# EAGLE design pcb-main (EAGLE 7.4.0)
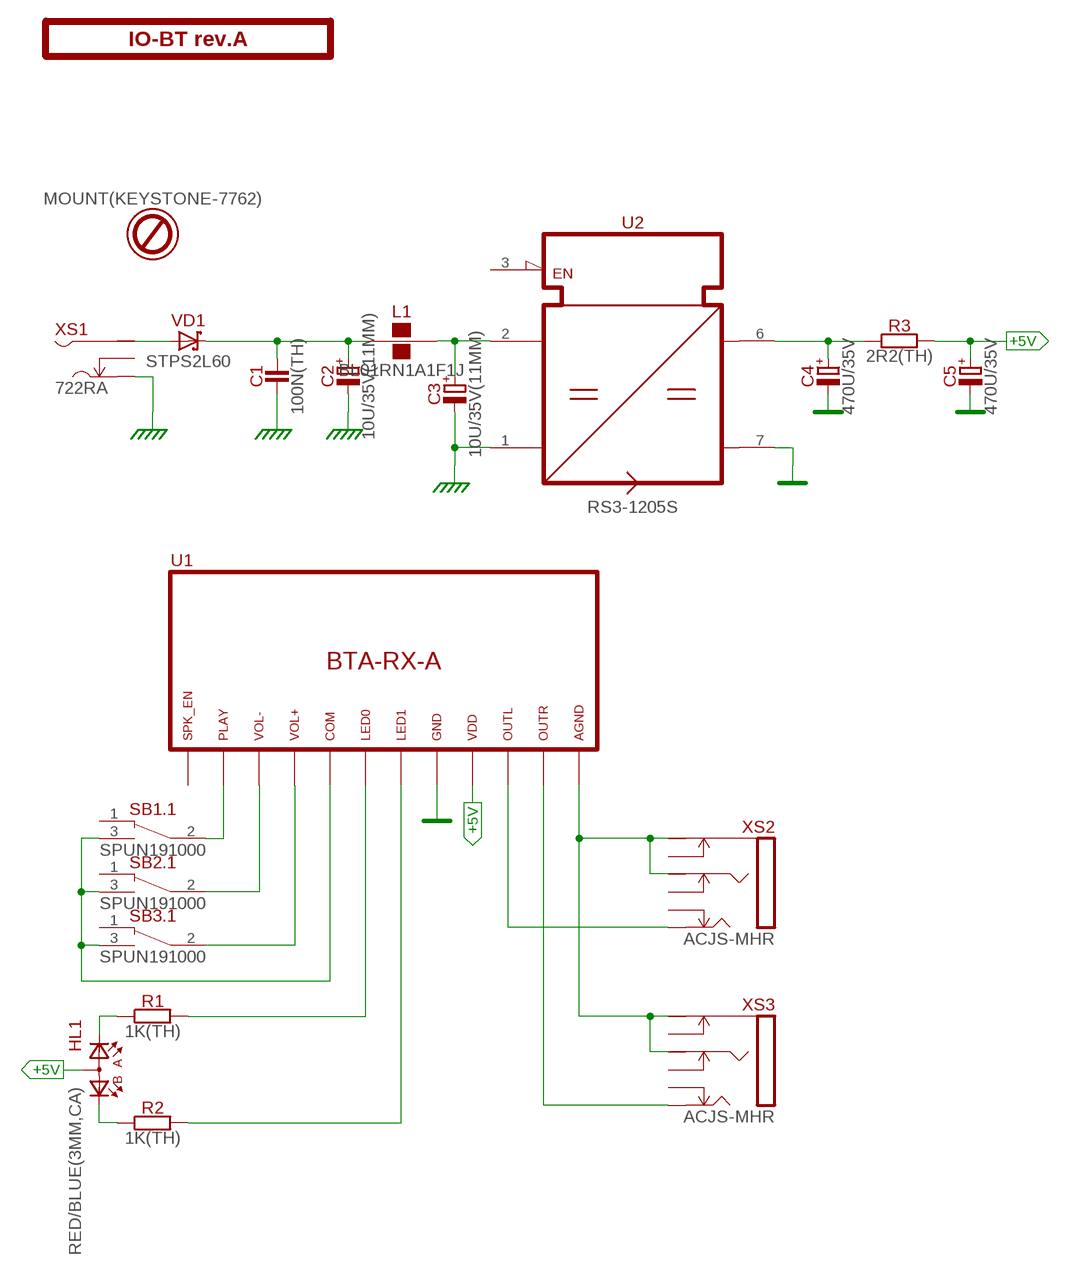
[diagram p0: schematic, sheet 1]

## Parts
C1  100N(TH)  [C050-024X044]
C2  10U/35V(11MM)  [E2-5]
C3  10U/35V(11MM)  [E2-5]
C4  470U/35V  [E5-10,5]
C5  470U/35V  [E5-10,5]
HL1  RED/BLUE(3MM,CA)  [DUOLED3MM-H]
L1  BL01RN1A1F1J  [BL01RN1A]
O1  MOUNT(KEYSTONE-7762)  [KEYSTONE-7762]
PCB1  IO-BT rev.A  GENERIC-LOGO  [F-LOGO]
R1  1K(TH)  [R-0207/10]
R2  1K(TH)  [R-0207/10]
R3  2R2(TH)  [R-0207/10]
SB1  SPUN191000  [SPUN-DPDT]
SB2  SPUN191000  [SPUN-DPDT]
SB3  SPUN191000  [SPUN-DPDT]
U1  BTA-RX-A  [BTA-RX]
U2  RS3-1205S  [SIP8]
VD1  STPS2L60  [DO41-10]
XS1  722RA  [SWITCHCRAFT-L712RA]
XS2  ACJS-MHR  [NMJ6HC-S]
XS3  ACJS-MHR  [NMJ6HC-S]

## Nets
+5V: C5.+ HL1.K(A) R3.2 U1.9
CHASSIS: C1.1 C2.- C3.- U2.1(IN-) XS1.S
GND: C4.- C5.- U1.8 U2.7(V-)
N$35: U1.12 XS2.R XS2.S XS3.R XS3.S
N$36: U1.10 XS2.T
N$37: U1.11 XS3.T
N$38: SB1.2(.1:CM) U1.2
N$39: SB2.2(.1:CM) U1.3
N$40: SB3.2(.1:CM) U1.4
N$41: SB1.3(.1:NO) SB2.3(.1:NO) SB3.3(.1:NO) U1.5
N$42: HL1.A1(K1) R1.1
N$43: HL1.A2(K2) R2.1
N$44: R1.2 U1.6
N$45: R2.2 U1.7
N$46: VD1.A XS1.P
N$47: C3.+ L1.2 U2.2(IN+)
N$48: C1.2 C2.+ L1.1 VD1.C
N$49: C4.+ R3.1 U2.6(V+)
Unconnected: O1.P$1 O1.P$2 O1.P$3 O1.P$4 SB1.1(.1:NC) SB1.4(.2:NC) SB1.5(.2:CM) SB1.6(.2:NO) SB2.1(.1:NC) SB2.4(.2:NC) SB2.5(.2:CM) SB2.6(.2:NO) SB3.1(.1:NC) SB3.4(.2:NC) SB3.5(.2:CM) SB3.6(.2:NO) U1.1 U2.3(EN) XS1.SS XS2.RN XS2.SN XS2.TN XS3.RN XS3.SN XS3.TN

## Library data of the parts
C1 = capacitors:?; MOUSER: 81-RCER71H104K0A2H3B
C2 C3 = capacitors-electrolytic:?; MOUSER: 75-515D106M035JA6AE3
C4 C5 = capacitors-electrolytic:?
HL1 = optoelectronics:?(3MM,CA)
L1 = inductors:BL01RN1A?; MOUSER: 81-BL01RN1A1F1J
O1 = hardware:MOUNT(?)
PCB1 = module-footprints:GENERIC
R1 R2 = resistors:?; MOUSER: 71-RN55D-F-1.0K
R3 = resistors:?
SB1-SB3 = switches:SPUN191000
U1 = module-wireless:BTA-RX-
U2 = regulators-switch-mode:RS3-1205S
VD1 = diodes-schottky:?; MOUSER: 511-STPS2L60RL
XS1 = connectors:722RA; MOUSER: 502-722RA
XS2 XS3 = connectors:ACJS-MHR; MOUSER: 523-ACJS-MHR

## Board
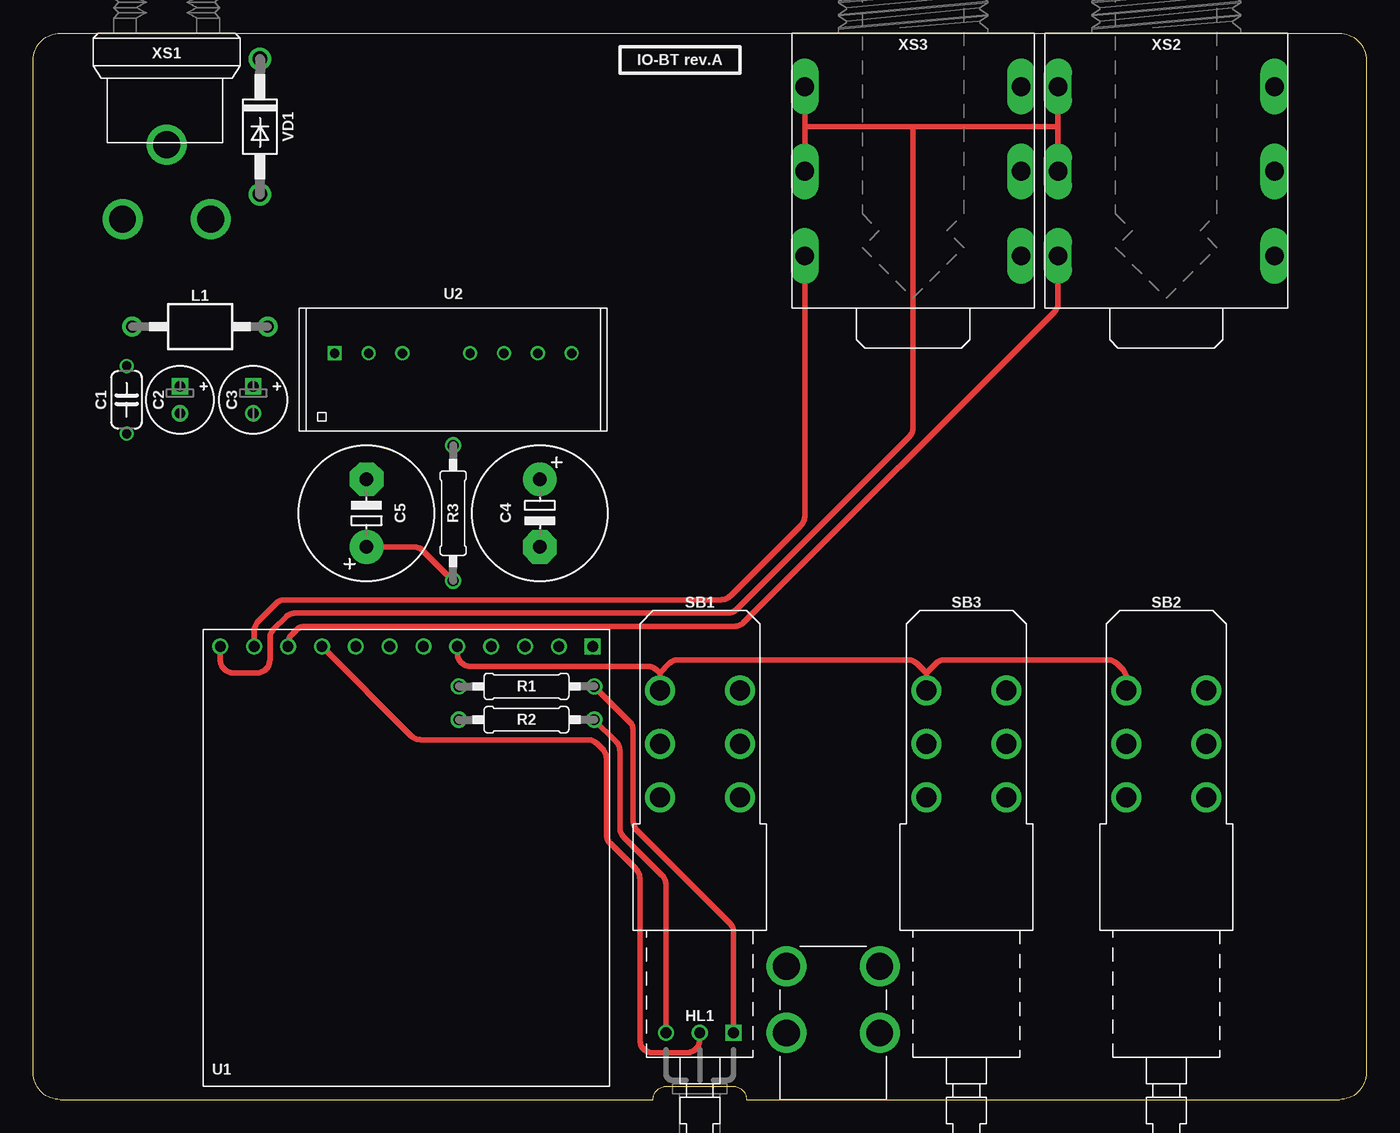
[diagram p1: board, top side]
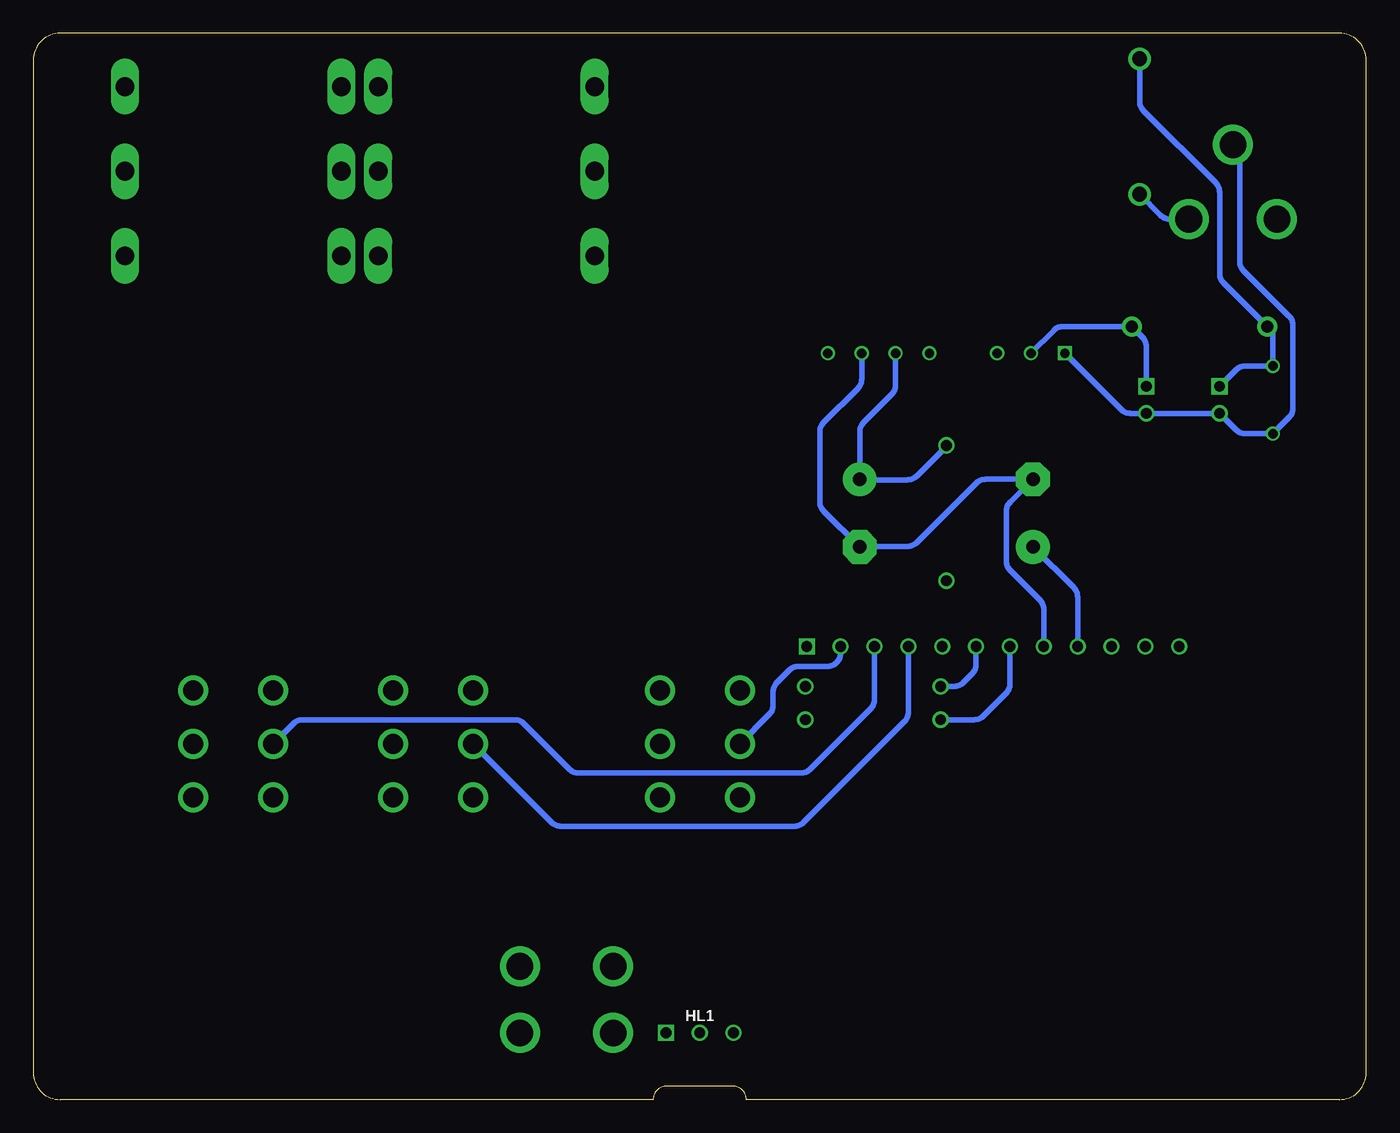
[diagram p2: board, bottom side, seen from below]

Size 100 x 80 mm. Coordinates in mm from the lower left corner, seen from the top.
Outline: 2,0 arc-90 0,2 0,78 arc-90 2,80 98,80 arc-90 100,78 100,2 arc-90 98,0 53.5,0 arc90 52.5,1 47.5,1 arc90 46.5,0 2,0
Copper layers (1*16): Top 0.0356mm / dielectric 1.5011mm / Bottom 0.0356mm
Design rules "fluorumlabs": minimum track width 6mil, minimum drill 13mil, track to track 8mil, track to pad 8mil, pad to pad 6mil, via to via 6mil, smd to smd 6mil, copper to edge 15mil, drill to drill 6mil, minimum pad ring 7mil, minimum via ring 7mil, stop-mask expansion 3mil, vias tented up to drill 25mil, thermal gap 10mil

### Footprints (pad centres in the part's own frame; a part is rotated, then mirrored left to right if it is on the bottom)
C050-024X044 = drill 0.7: 1 -2.54,0; 2 2.54,0
E2-5 = drill 0.813 square: + -1.016,0 | drill 0.813: - 1.016,0
E5-10,5 = drill 1.016 pad 2.54: + -2.54,0 | drill 1.016 pad 2.54 octagon: - 2.54,0
DUOLED3MM-H = drill 0.813 square: A1 -2.54,0 | drill 0.813: A2 2.54,0; K 0,0
BL01RN1A = drill 0.9 pad 1.5: 1 -5.08,0; 2 5.08,0
KEYSTONE-7762 = drill 2: P$1 -3.5,5; P$2 3.5,5; P$3 -3.5,10; P$4 3.5,10
R-0207/10 = drill 0.813: 1 -5.08,0; 2 5.08,0
SPUN-DPDT = drill 1.5: 1 3,-19.685; 2 3,-23.685; 3 3,-27.685; 4 -3,-19.685; 5 -3,-23.685; 6 -3,-27.685
BTA-RX = drill 0.8 square: 1 -13.97,0 | drill 0.8: 2 -11.43,0; 3 -8.89,0; 4 -6.35,0; 5 -3.81,0; 6 -1.27,0; 7 1.27,0; 8 3.81,0; 9 6.35,0; 10 8.89,0; 11 11.43,0; 12 13.97,0
SIP8 = drill 0.7 square: 1 -8.89,0 | drill 0.7: 2 -6.35,0; 3 -3.81,0; 5 1.27,0; 6 3.81,0; 7 6.35,0; 8 8.89,0
DO41-10 = drill 1.118: A 5.08,0; C -5.08,0
SWITCHCRAFT-L712RA = drill 2: P 13.945,3.302; S 8.357,0; SS 13.945,-3.302
NMJ6HC-S = drill 1.4 long: R -10.35,8.115; RN -10.35,-8.115; S -4,8.115; SN -4,-8.115; T -16.7,8.115; TN -16.7,-8.115

### Placement (x,y rotation side)
C1  7,52.5 90 top
C2  11,52.5 270 top
C3  16.5,52.5 270 top
C4  38,44 270 top
C5  25,44 90 top
E$1  [B*-080]  0,0 0 top
HL1  50,5 180 top
L1  12.5,58 0 top
O1  60,0 0 top
PCB1  48.5,78 0 top
R1  37,31 180 top
R2  37,28.5 180 top
R3  31.5,44 270 top
SB1  50,3 180 top
SB2  85,3 180 top
SB3  70,3 180 top
U1  28,34 180 top
U2  31.5,56 0 top
VD1  17,73 270 top
XS1  10,80 270 top
XS2  85,80 90 top
XS3  66,80 90 top

### Tracks (layer width: path | path; a pad name or v marks a point on that pad's centre or on a via)
+5V
  Top 0.406: C5.+ 28.55,41.46 arc-45 29.25,41.17 R3.2 | HL1.K 50,4.5 arc-90 49,3.5 46.5,3.5 arc-90 45.5,4.5 45.5,16.59 arc45 45.21,17.29 43.29,19.21 arc-45 43,19.91 43,25.59 arc45 42.71,26.29 42.29,26.71 arc45 41.59,27 29.06,27 arc-45 28.36,27.29 U1.9
  Bottom 0.406: U1.9 21.65,37.7 arc-45 21.94,38.4 C5.+
CHASSIS
  Bottom 0.406: U2.1 18.39,51.78 arc-45 17.68,51.48 C3.- C2.- 9.77,50.25 arc-45 9.06,49.96 C1.1 5.79,51.17 arc-45 5.5,51.87 5.5,58.09 arc-45 5.79,58.79 9.21,62.21 arc45 9.5,62.91 9.5,70.59 arc-45 9.79,71.29 10,71.5 XS1.S
GND
  Bottom 0.406: U2.7 37.85,54.06 arc45 38.14,53.36 40.71,50.79 arc-45 41,50.09 41,44.87 arc-45 40.71,44.17 C4.- 37.96,41.5 34.41,41.5 arc-45 33.71,41.79 29.25,46.25 arc45 28.55,46.54 C5.- 26.71,44.83 arc-45 27,44.13 27,40.41 arc-45 26.71,39.71 24.48,37.48 arc45 24.19,36.78 U1.8
N$35
  Top 0.406: XS3.R XS3.S 57.88,73.11 58,73 66,73 | XS2.R 76.89,73 | 76.89,73 XS2.S | 66,73 76.89,73 | U1.12 14.03,33 arc90 15.03,32 16.75,32 arc90 17.75,33 17.75,34.59 arc-45 18.04,35.29 18.96,36.21 arc-45 19.66,36.5 52.09,36.5 arc45 52.79,36.79 65.71,49.71 arc45 66,50.41 66,73
N$36
  Top 0.406: U1.10 19.11,34.2 arc-45 19.4,34.9 19.71,35.21 arc-45 20.41,35.5 52.59,35.5 arc45 53.29,35.79 76.59,59.09 arc45 76.89,59.8 XS2.T
N$37
  Top 0.406: U1.11 16.57,35.16 arc-45 16.86,35.86 18.21,37.21 arc-45 18.91,37.5 51.59,37.5 arc45 52.29,37.79 57.25,42.75 57.5,43 57.59,43.09 arc45 57.88,43.8 XS3.T
N$38
  Bottom 0.406: U1.2 39.43,33.5 arc90 40.43,32.5 42.59,32.5 arc-45 43.29,32.21 44.21,31.29 arc-45 44.5,30.59 44.5,29.6 arc45 44.79,28.89 SB1.2
N$39
  Bottom 0.406: U1.3 36.89,30.02 arc45 37.18,29.32 41.71,24.79 arc45 42.41,24.5 59.09,24.5 arc45 59.79,24.79 63.21,28.21 arc-45 63.91,28.5 79.77,28.5 arc-45 80.48,28.21 SB2.2
N$40
  Bottom 0.406: U1.4 34.35,29.06 arc45 34.64,28.36 42.21,20.79 arc45 42.91,20.5 60.4,20.5 arc45 61.11,20.79 SB3.2
N$41
  Top 0.406: SB1.3 47,32 | 47,32 47.71,32.71 arc-45 48.41,33 65.59,33 arc-45 66.29,32.71 67,32 | 67,32 SB3.3 | SB2.3 82,31.59 arc45 81.71,32.29 81.29,32.71 arc45 80.59,33 68.41,33 arc45 67.71,32.71 67,32 | U1.5 31.81,33.5 arc90 32.81,32.5 46.09,32.5 arc-45 46.79,32.21 47,32
N$42
  Top 0.406: HL1.A1 52.54,12.55 arc45 52.25,13.25 45.29,20.21 arc-45 45,20.91 45,27.67 arc45 44.71,28.37 R1.1
N$43
  Top 0.406: HL1.A2 47.46,16.13 arc45 47.17,16.83 44.29,19.71 arc-45 44,20.41 44,26.17 arc45 43.71,26.87 R2.1
N$44
  Bottom 0.406: U1.6 29.27,32.64 arc45 29.56,31.94 30.21,31.29 arc45 30.91,31 R1.2
N$45
  Bottom 0.406: R2.2 29.41,28.5 arc-45 28.71,28.79 27.02,30.48 arc-45 26.73,31.18 U1.7
N$46
  Bottom 0.406: XS1.P 14.72,66.06 arc45 15.43,66.35 VD1.A
N$47
  Bottom 0.406: C3.+ 16.5,56.51 arc-45 16.79,57.21 L1.2 22.74,58 arc-45 23.44,57.71 U2.2
N$48
  Bottom 0.406: C2.+ 9.77,54.75 arc45 9.06,55.04 C1.2 7,57.58 L1.1 10.71,61.29 arc45 11,61.99 11,68.09 arc-45 11.29,68.79 16.71,74.21 arc45 17,74.91 VD1.C
N$49
  Bottom 0.406: U2.6 35.31,53.6 arc45 35.6,52.9 37.71,50.79 arc-45 38,50.09 C4.+ 37.96,46.5 34.41,46.5 arc-45 33.71,46.79 31.5,49 R3.1